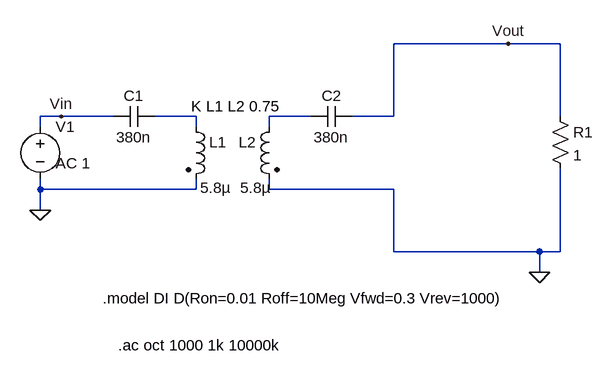
[diagram p0: schematic AC Analysis.asc]
AC Analysis.asc, the LTspice schematic file:
Version 4
SHEET 1 1232 744
WIRE 1056 96 880 96
WIRE 1136 96 1056 96
WIRE 368 208 336 208
WIRE 448 208 368 208
WIRE 576 208 512 208
WIRE 752 208 688 208
WIRE 880 208 880 96
WIRE 880 208 816 208
WIRE 1136 208 1136 96
WIRE 336 224 336 208
WIRE 576 224 576 208
WIRE 688 224 688 208
WIRE 336 320 336 304
WIRE 576 320 576 304
WIRE 576 320 336 320
WIRE 688 320 688 304
WIRE 880 320 688 320
WIRE 336 352 336 320
WIRE 880 416 880 320
WIRE 1104 416 880 416
WIRE 1136 416 1136 288
WIRE 1136 416 1104 416
WIRE 1104 448 1104 416
FLAG 1056 96 Vout
FLAG 1104 448 0
FLAG 336 352 0
FLAG 368 208 Vin
SYMBOL voltage 336 208 R0
WINDOW 123 24 72 Left 2
WINDOW 39 0 0 Left 0
WINDOW 3 24 44 Left 2
SYMATTR Value2 AC 1
SYMATTR Value ""
SYMATTR InstName V1
SYMBOL ind2 560 208 R0
WINDOW 3 22 110 Left 2
SYMATTR Value 5.8µ
SYMATTR InstName L1
SYMATTR Type ind
SYMATTR SpiceLine Rser=12m
SYMBOL ind2 704 208 M0
WINDOW 3 13 110 Left 2
SYMATTR Value 5.8µ
SYMATTR InstName L2
SYMATTR Type ind
SYMATTR SpiceLine Rser=12m
SYMBOL cap 512 192 R90
WINDOW 0 0 32 VBottom 2
WINDOW 3 32 32 VTop 2
SYMATTR InstName C1
SYMATTR Value 380n
SYMATTR SpiceLine Rser=0.01 Lser=1n
SYMBOL cap 816 192 R90
WINDOW 0 0 32 VBottom 2
WINDOW 3 32 32 VTop 2
SYMATTR InstName C2
SYMATTR Value 380n
SYMATTR SpiceLine Rser=0.01 Lser=1n
SYMBOL res 1120 192 R0
SYMATTR InstName R1
SYMATTR Value 1
TEXT 568 192 Left 2 !K L1 L2 0.75
TEXT 432 488 Left 2 !.model DI D(Ron=0.01 Roff=10Meg Vfwd=0.3 Vrev=1000)
TEXT 456 560 Left 2 !.ac oct 1000 1k 10000k

The netlist it stands for:
* AC Analysis.asc
V1 Vin 0 AC 1
L1 N001 0 5.8µ Rser=12m
L2 N002 0 5.8µ Rser=12m
C1 N001 Vin 380n Rser=0.01 Lser=1n
C2 Vout N002 380n Rser=0.01 Lser=1n
R1 Vout 0 1
K L1 L2 0.75
.model DI D(Ron=0.01 Roff=10Meg Vfwd=0.3 Vrev=1000)
.ac oct 1000 1k 10000k
.backanno
.end